# Altium schematic sheet TM-2022-31_TM-2022-3.schdoc
size 124 x 99 mm
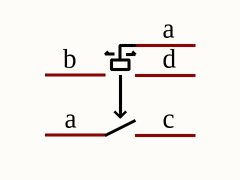
[diagram p0: TM-2022-31_TM-2022-3.schdoc]

## Parts
SW?  TM-2022-3  [SW-SMD_TM-2022-3]  (value not drawn)

## Nets

Not connected (* = marked no-connect by the designer): SW? a b c d

## Library data of the parts
SW? = TM-2022-3: Manufacturer: XKB Connectivity(中国星坤); Add into BOM: yes; Name: TM-2022-3; Symbol: TM-2022-3; Device: TM-2022-3; LCSC Part Name: 数码相机拨轮开关  3挡拨轮开关; Supplier Part: C318952; Manufacturer Part: TM-2022-3; Supplier Footprint: SMD; JLCPCB Part Class: Extended Part; Datasheet: https://atta.szlcsc.com/upload/public/pdf/source/20211015/3476D939D9FB2BD124C91E3A6F460D4F.pdf; Supplier: LCSC; Convert to PCB: yes